# EAGLE design goodfet31R (EAGLE 5.00)
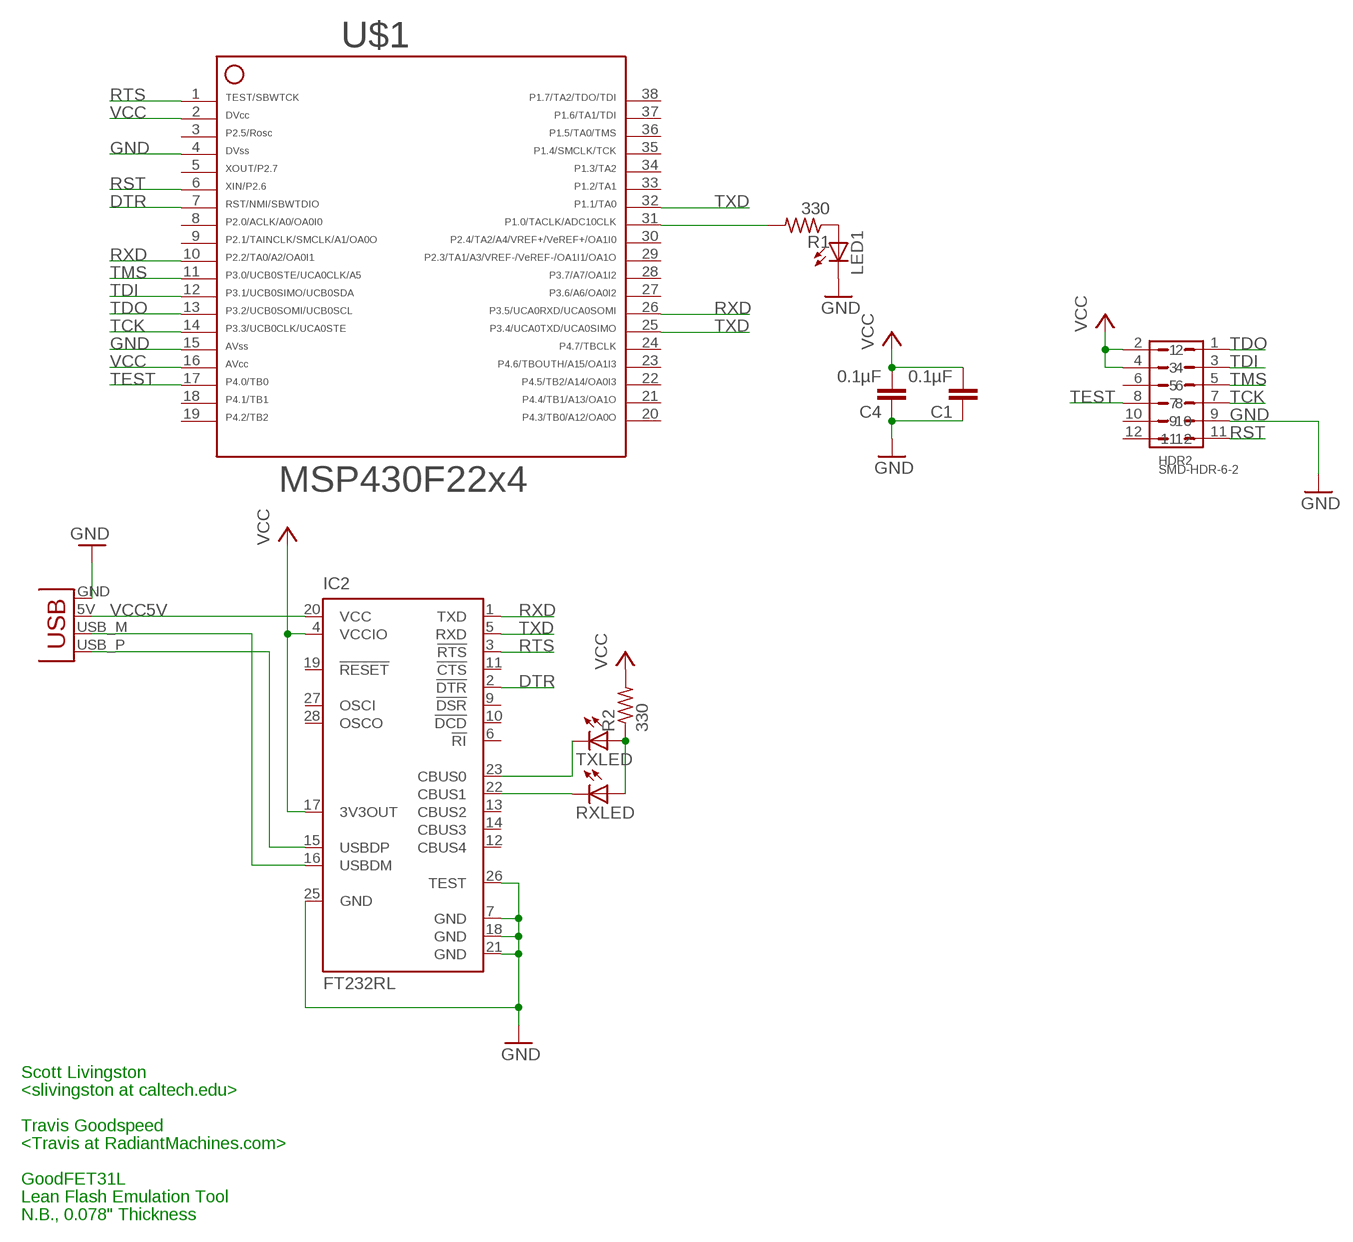
[diagram p0: schematic, sheet 1]

## Parts
C1  0.1µF  C-EUC0603  [C0603]
C4  0.1µF  C-EUC0603  [C0603]
HDR2  SMD-HDR-6-2  [SMD-HDR-6-2]
IC2  FT232RL  [SSOP28]
LED1  LEDCHIP-LED0603  [CHIP-LED0603]
R1  330  R-US_R0603  [R0603]
R2  330  R-US_R0603  [R0603]
RXLED  LEDCHIP-LED0603  [CHIP-LED0603]
TXLED  LEDCHIP-LED0603  [CHIP-LED0603]
U$1  F22X4---DA38  [DA38]
X1  USBPCB  [USB-A-PCB]

## Nets
DTR: IC2.2(!DTR) U$1.7
GND: C1.1 C4.1 HDR2.9 IC2.7(GND) IC2.18(GND) IC2.21(GND) IC2.25(GND) IC2.26(TEST) LED1.C U$1.4 U$1.15 X1.GND
N$2: IC2.22(CBUS1) RXLED.C
N$3: IC2.15(USBDP) X1.USB_P(D+)
N$4: IC2.16(USBDM) X1.USB_M(D-)
N$5: IC2.23(CBUS0) TXLED.C
N$8: R2.1 RXLED.A TXLED.A
N$10: LED1.A R1.1
N$18: R1.2 U$1.31
RST: HDR2.11 U$1.6
RTS: IC2.3(!RTS) U$1.1
RXD: IC2.1(TXD) U$1.10 U$1.26
TCK: HDR2.7 U$1.14
TDI: HDR2.3 U$1.12
TDO: HDR2.1 U$1.13
TEST: HDR2.8 U$1.17
TMS: HDR2.5 U$1.11
TXD: IC2.5(RXD) U$1.25 U$1.32
VCC: C1.2 C4.2 HDR2.2 HDR2.4 IC2.4(VCCIO) IC2.17(3V3OUT) R2.2 U$1.2 U$1.16
VCC5V: IC2.20(VCC) X1.5V(VBUS)
Unconnected: HDR2.6 HDR2.10 HDR2.12 IC2.6(!RI) IC2.9(!DSR) IC2.10(!DCD) IC2.11(!CTS) IC2.12(CBUS4) IC2.13(CBUS2) IC2.14(CBUS3) IC2.19(!RESET) IC2.27(OSCI) IC2.28(OSCO) U$1.3 U$1.5 U$1.8 U$1.9 U$1.18 U$1.19 U$1.20 U$1.21 U$1.22 U$1.23 U$1.24 U$1.27 U$1.28 U$1.29 U$1.30 U$1.33 U$1.34 U$1.35 U$1.36 U$1.37 U$1.38

## Notes on the sheet
- Scott Livingston
- <slivingston at caltech.edu>
- Travis Goodspeed
- <Travis at RadiantMachines.com>
- GoodFET31L
- Lean Flash Emulation Tool
- N.B., 0.078" Thickness

## Library data of the parts
C1 C4 = rcl:C-EU: CAPACITOR, European symbol
HDR2 = scott_eagle:SMD-HDR-6-2
IC2 = ftdichip:FT232R: Source: http://www.ftdichip.com/Documents/DataSheets/DS_FT232R_v104.pdf
LED1 RXLED TXLED = led:LED: LED OSRAM: - CHIPLED LG R971, LG N971, LY N971, LG Q971, LY Q971, LO R971, LY R971 LH N974, LH R974 LS Q976, LO Q976, LY Q976 LO Q996 - Hyper CHIPLED LW Q18S LB Q993, LB Q99A, LB R99A - SideLED LS A670, LO A670, LY A670, LG A670, LP A670 LB A673, LV A673, LT A673, LW A673 LH A674 LY A675 LS A676, LA A676, LO A676, LY A676, LW A676 LS A679, LY A679, LG A679 - Hyper Micro SIDELED® LS Y876, LA Y876, LO Y876, LY Y876 LT Y87S - SmartLED LW L88C, LW L88S LB L89C, LB L89S, LG L890 LS L89K, LO L89K, LY L89K LS L896, LA L896, LO L896, LY L896 - TOPLED LS T670, LO T670, LY T670, LG T670, LP T670 LSG T670, LSP T670, LSY T670, LOP T670, LYG T670 LG T671, LOG T671, LSG T671 LB T673, LV T673, LT T673, LW T673 LH T674 LS T676, LA T676, LO T676, LY T676, LB T676, LH T676, LSB T676, LW T676 LB T67C, LV T67C, LT T67C, LS T67K, LO T67K, LY T67K, LW E67C LS E67B, LA E67B, LO E67B, LY E67B, LB E67C, LV E67C, LT E67C LW T67C LS T679, LY T679, LG T679 LS T770, LO T770, LY T770, LG T770, LP T770 LB T773, LV T773, LT T773, LW T773 LH T774 LS E675, LA E675, LY E675, LS T675 LS T776, LA T776, LO T776, LY T776, LB T776 LHGB T686 LT T68C, LB T68C - Hyper Mini TOPLED® LB M676 - Mini TOPLED Santana® LG M470 LS M47K, LO M47K, LY M47K Source: http://www.osram.convergy.de LUXEON: - LUMILED® LXK2-PW12-R00, LXK2-PW12-S00, LXK2-PW14-U00, LXK2-PW14-V00 LXK2-PM12-R00, LXK2-PM12-S00, LXK2-PM14-U00 LXK2-PE12-Q00, LXK2-PE12-R00, LXK2-PE12-S00, LXK2-PE14-T00, LXK2-PE14-U00 LXK2-PB12-K00, LXK2-PB12-L00, LXK2-PB12-M00, LXK2-PB14-N00, LXK2-PB14-P00, LXK2-PB14-Q00 LXK2-PR12-L00, LXK2-PR12-M00, LXK2-PR14-Q00, LXK2-PR14-R00 LXK2-PD12-Q00, LXK2-PD12-R00, LXK2-PD12-S00 LXK2-PH12-R00, LXK2-PH12-S00 LXK2-PL12-P00, LXK2-PL12-Q00, LXK2-PL12-R00 Source: www.luxeon.com KINGBRIGHT: KA-3528ASYC Source: www.kingbright.com
R1 R2 = rcl:R-US_: RESISTOR, American symbol
U$1 = TI_MSP430_v122:F22X4---DA38: ***MSP430F22x4***DA38
X1 = SparkFun:USB: USB Connectors USB-B-PTH is fully proven SKU : PRT-00139 USB-miniB is fully proven SKU : PRT-00587 USB-A-PCB is untested. USB-A-H is throughly reviewed, but untested. Spark Fun Electronics SKU : PRT-00437 USB-B-SMT is throughly reviewed, but untested. Needs silkscreen touching up. USB-A-S has not been used/tested USB-MB-H has not been used/tested

## Board
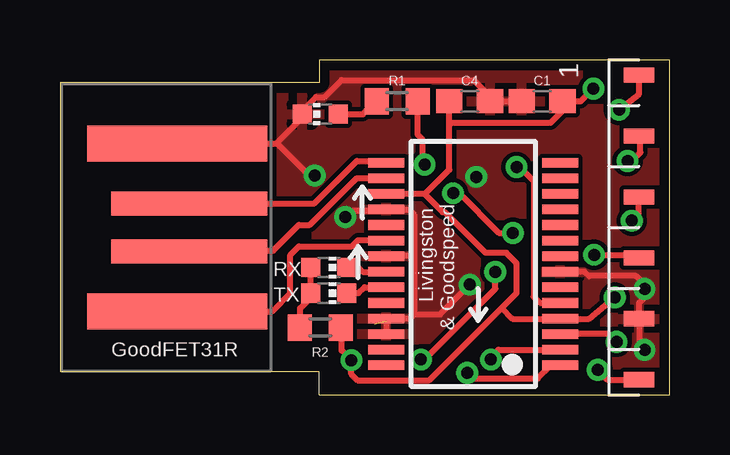
[diagram p1: board, top side]
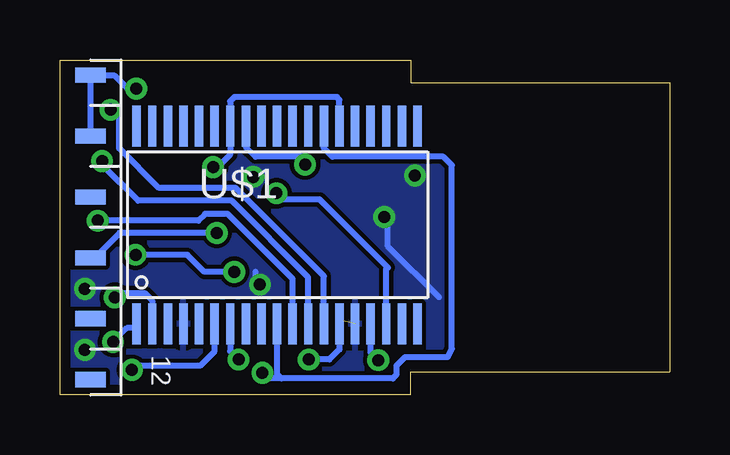
[diagram p2: board, bottom side, seen from below]

Size 25.4 x 13.97 mm. Coordinates in mm from the lower left corner, seen from the top.
Outline: 10.79,0 25.4,0 25.4,13.97 10.79,13.97 10.79,13.02 0,13.02 0,0.95 10.79,0.95 10.79,0
Copper layers (1*16): Top 0.035mm / dielectric 1.5mm / Bottom 0.035mm
Design rules "gf": minimum track width 7mil, minimum drill 15mil, track to track 7mil, track to pad 7mil, pad to pad 7mil, via to via 7mil, smd to smd 7mil, copper to edge 17mil, drill to drill 8mil, minimum pad ring 10mil, minimum via ring 8mil, stop-mask expansion 4mil, vias tented up to drill 0mil, thermal gap 10mil

### Footprints (pad centres in the part's own frame; a part is rotated, then mirrored left to right if it is on the bottom)
C0603 = smd 1.1 x 1: 1 -0.85,0; 2 0.85,0
SMD-HDR-6-2 = smd 1.27 x 0.635: 1 1.27,6.35; 3 1.27,3.81; 5 1.27,1.27; 7 1.27,-1.27; 9 1.27,-3.81; 11 1.27,-6.35 | smd 1.27 x 0.635 bottom: 2 1.27,6.35; 4 1.27,3.81; 6 1.27,1.27; 8 1.27,-1.27; 10 1.27,-3.81; 12 1.27,-6.35
SSOP28 = smd 0.4 x 1.5: 1 -4.225,-3.625; 2 -3.575,-3.625; 3 -2.925,-3.625; 4 -2.275,-3.625; 5 -1.625,-3.625; 6 -0.975,-3.625; 7 -0.325,-3.625; 8 0.325,-3.625; 9 0.975,-3.625; 10 1.625,-3.625; 11 2.275,-3.625; 12 2.925,-3.625; 13 3.575,-3.625; 14 4.225,-3.625; 15 4.225,3.625; 16 3.575,3.625; 17 2.925,3.625; 18 2.275,3.625; 19 1.625,3.625; 20 0.975,3.625; 21 0.325,3.625; 22 -0.325,3.625; 23 -0.975,3.625; 24 -1.625,3.625; 25 -2.275,3.625; 26 -2.925,3.625; 27 -3.575,3.625; 28 -4.225,3.625
CHIP-LED0603 = smd 0.8 x 0.8: A 0,-0.75; C 0,0.75
R0603 = smd 1 x 1.1: 1 -0.85,0; 2 0.85,0
DA38 = smd 0.35 x 1.705: 1 -5.85,-4.12; 2 -5.2,-4.12; 3 -4.55,-4.12; 4 -3.9,-4.12; 5 -3.25,-4.12; 6 -2.6,-4.12; 7 -1.95,-4.12; 8 -1.3,-4.12; 9 -0.65,-4.12; 10 0,-4.12; 11 0.65,-4.12; 12 1.3,-4.12; 13 1.95,-4.12; 14 2.6,-4.12; 15 3.25,-4.12; 16 3.9,-4.12; 17 4.55,-4.12; 18 5.2,-4.12; 19 5.85,-4.12; 20 5.85,4.12; 21 5.2,4.12; 22 4.55,4.12; 23 3.9,4.12; 24 3.25,4.12; 25 2.6,4.12; 26 1.95,4.12; 27 1.3,4.12; 28 0.65,4.12; 29 0,4.12; 30 -0.65,4.12; 31 -1.3,4.12; 32 -1.95,4.12; 33 -2.6,4.12; 34 -3.25,4.12; 35 -3.9,4.12; 36 -4.55,4.12; 37 -5.2,4.12; 38 -5.85,4.12
USB-A-PCB = smd 7.5 x 1.5: 5V -0.2,-3.5; GND -0.2,3.5 | smd 6.5 x 1: USB_M 0.3,-1; USB_P 0.3,1

### Placement (x,y rotation side)
C1  20.09,12.24 0 top
C4  17.07,12.24 180 top
HDR2  22.86,6.99 0 top
IC2  17.22,5.46 90 top
LED1  10.85,11.71 90 top
R1  14.05,12.24 0 top
R2  10.85,2.81 0 top
RXLED  11.2,5.31 270 top
TXLED  11.2,4.24 270 top
U$1  16.36,7.09 0 bottom
X1  5.08,6.99 0 top

### Tracks (layer width: path | path; a pad name or v marks a point on that pad's centre or on a via)
DTR  (via drill 0.5)
  Top 0.254: IC2.2 18.27,1.89 v17.96,1.47
  Bottom 0.254: U$1.7 18.31,1.82 v17.96,1.47
GND  (via drill 0.5)  (1 unrouted)
  Top 0.254: 20.67,5.14 20.65,5.16 | 20.67,5.14 IC2.7 | 20.67,5.14 20.68,5.13 | IC2.26 13.6,3.08 13.69,3.18 | 14.76,3.35 14.58,3.18 13.69,3.18 | 13.69,3.18 13.68,3.19 IC2.25 | IC2.18 13.63,7.74 13.79,7.7 12.07,7.7 v11.89,7.42 | 13.51,7.8 13.57,7.74 IC2.18 | 14.76,3.35 15.82,3.35 v17.07,4.6 | 20.67,5.14 21.86,5.14 22.05,4.95 24,4.95 24.36,4.6 v24.36,4.42 24.36,4.06 24.13,3.84 24.13,3.2 24.11,3.18 HDR2.9 24.13,2.16 24.36,1.93 v24.36,1.88 | IC2.18 13.61,7.75 13.64,7.72 | 17.96,12.24 17.95,12.26 C4.1 | 14.76,5.84 14.76,7.52 14.55,7.72 13.69,7.72 13.64,7.77 IC2.18 | 14.76,5.84 14.76,3.35 | IC2.18 | IC2.21 14.7,5.79 14.76,5.84 | v10.61,9.14 10.31,9.22 9.05,10.49 | X1.GND 9.05,10.49 | 9.05,10.49 9.05,10.52 9.93,11.41 9.92,11.42 LED1.C 9.96,11.71 10.67,12.42 11.02,12.42 11.73,13.13 17.25,13.13 17.96,12.42 17.96,12.24 | C4.1 17.78,12.24 | 17.96,12.24 C1.1 | 17.96,12.24 C4.1
  Bottom 0.254: 9.6,4.06 11.73,6.2 11.73,7.26 v11.89,7.42 | 17.25,5.13 17.25,4.42 v17.07,4.6
  other vias: 17.35,9.09
  pour Bottom: 10.85,14.02 25.43,14.02 25.43,-0.03 10.85,-0.03 10.85,0.86 8.89,0.86 8.89,12.95 10.85,12.95
  pour Top: 10.85,14.02 25.43,14.02 25.43,-0.03 10.85,-0.03 10.85,0.86 9.78,0.86 9.78,1.04 9.25,1.04 9.25,12.95 10.85,12.95
N$2
  Top 0.254: RXLED.C 12.45,5.31 12.62,5.14 IC2.22
N$3
  Top 0.254: X1.USB_P 10.6,7.99 12.37,9.75 13.51,9.75 13.58,9.69 IC2.15
N$4
  Top 0.254: IC2.16 13.68,9.04 13.69,9.04 12.37,9.04 10.41,7.09 9.96,7.09 8.89,6.02 5.51,6.02 5.48,5.98 X1.USB_M
N$5
  Top 0.254: TXLED.C 12.45,4.24 12.69,4.49 IC2.23
N$8
  Top 0.254: 10,2.5 9.96,2.46 | 10,2.5 R2.1 10,2.83 9.93,2.9 10.01,2.97 10.01,3.61 10.45,4.05 TXLED.A 10.49,4.42 10.45,4.46 RXLED.A | 10,2.5 10.1,2.6
N$10
  Top 0.254: 11.56,11.71 LED1.A 12.62,11.71 13.16,12.24 | 13.16,12.24 12.98,12.24 | 13.16,12.24 R1.1
N$18  (via drill 0.5)
  Top 0.254: R1.2 14.9,10.86 15.11,10.64 15.11,9.63 v15.19,9.6
  Bottom 0.254: U$1.31 17.66,10.34 17.25,9.93 15.29,9.93 15.09,9.73 v15.19,9.6
RST  (via drill 0.5)
  Top 0.254: 23.6,0.64 HDR2.11 22.81,0.64 v22.4,1.04
  Bottom 0.254: v22.4,1.04 22.23,1.22 19.56,1.22 18.96,1.82 U$1.6
RTS  (via drill 0.5)
  Top 0.254: 20.85,2.6 IC2.3 22.86,2.54 v23.19,2.21
  Bottom 0.254: U$1.1 22.26,2.79 22.61,2.79 v23.19,2.21
RXD  (via drill 0.5)
  Top 0.254: IC2.1 20.82,1.24 20.8,1.22 20.45,1.22 19.91,0.69 17.2,0.69 v16.97,0.91
  Bottom 0.254: 16.18,0.69 11.53,0.69 11.38,0.84 11.38,1.22 11.02,1.58 9.25,1.58 9.07,1.93 9.07,9.58 9.42,9.93 14.05,9.93 14.41,10.29 U$1.26 | 16.18,0.69 16.74,0.69 v16.97,0.91 | U$1.10 16.36,0.86 16.18,0.69
TCK  (via drill 0.5)
  Top 0.254: v18.14,5.13 18.14,4.42 15.19,1.47 v15.04,1.47 | 24.18,5.66 HDR2.7 24.18,5.84 v22.25,5.84
  Bottom 0.254: v18.14,5.13 19.38,5.13 20.09,5.84 v22.25,5.84 | U$1.14 13.76,1.89 14.17,1.47 v15.04,1.47
TDI  (via drill 0.5)
  Top 0.254: v23.65,9.75 23.82,9.75 24.18,10.11 24.18,10.82 24.16,10.79 HDR2.3
  Bottom 0.254: v23.65,9.75 23.65,9.58 22.15,8.1 18.24,8.1 15.06,4.9 U$1.12
TDO  (via drill 0.5)
  Top 0.254: HDR2.1 24.13,12.55 v23.29,11.89
  Bottom 0.254: U$1.13 14.41,4.95 14.4,4.95 18.09,8.64 21.29,8.64 22.94,10.29 22.94,11.53 v23.29,11.89
TEST  (via drill 0.5)
  Top 0.254: v16.38,8.41 16.64,8.41 18.29,6.76 v18.87,6.76
  Bottom 0.254: HDR2.8 23.7,5.71 | HDR2.8 24.16,5.71 | HDR2.8 24.18,5.66 | v16.38,8.41 16.12,8.15 14.58,8.15 11.73,5.31 11.81,5.24 U$1.17 | HDR2.8 24.05,5.71 24,5.66 22.91,6.76 v18.87,6.76
TMS  (via drill 0.5)
  Top 0.254: HDR2.5 24.11,8.08 24.11,7.54 v23.82,7.26
  Bottom 0.254: U$1.11 15.71,4.84 18.41,7.54 19.36,7.54 19.63,7.26 v23.82,7.26
TXD  (via drill 0.5)
  Top 0.254: IC2.5 20.8,3.84 19.99,3.84 19.74,4.09 19.74,8.92 19.15,9.5 v19.02,9.5
  Bottom 0.254: U$1.25 13.76,12.31 13.87,12.42 18.14,12.42 18.31,12.24 18.31,11.18 U$1.32 18.31,10.01 18.82,9.5 v19.02,9.5
VCC  (via drill 0.5)
  Top 0.254: IC2.4 20.66,3.19 20.65,3.18 20.62,3.2 | 20.62,3.18 20.64,3.19 IC2.4 | 11.73,2.64 11.7,2.68 R2.2 11.72,2.81 11.73,2.82 11.73,1.85 v12.14,1.45 12.14,0.86 12.39,0.61 15.39,0.61 18.4,3.62 | 20.98,3.18 20.97,3.19 IC2.4 | 20.98,3.18 22.05,3.18 v23.11,4.06 | 18.4,3.62 19.02,4.24 19.02,5.49 18.6,5.92 17.74,5.92 16.04,7.62 15.95,7.62 15.2,8.37 | 16.19,12.26 C4.2 16.22,11.28 | IC2.17 14.88,8.39 15.2,8.37 | 16.22,11.28 16.22,9.39 15.2,8.37 | v22.23,12.78 21.69,12.24 C1.2 20.94,11.85 20.45,11.35 16.31,11.35 16.23,11.28 16.22,11.28 | 20.98,3.18 18.85,3.18 18.4,3.62
  Bottom 0.254: HDR2.2 24.13,10.87 24.18,10.82 24.16,10.79 HDR2.4 | 24.18,13.31 24.16,13.34 HDR2.2 | v22.23,12.78 22.58,12.78 23.11,13.31 24,13.31 24.03,13.34 HDR2.2 | 12.09,1.4 v12.14,1.45 12.46,1.76 U$1.16 | U$1.2 21.56,3.93 21.87,4.24 22.94,4.24 v23.11,4.06
VCC5V
  Top 0.254: 13.64,6.4 IC2.20 13.59,6.43 13.56,6.45 12.42,6.45 12.17,6.2 9.96,6.2 9.6,5.84 9.6,4.24 8.84,3.48 X1.5V

### Text on the board
tPlace: Livingston | & Goodspeed | RX | TX | GoodFET31R